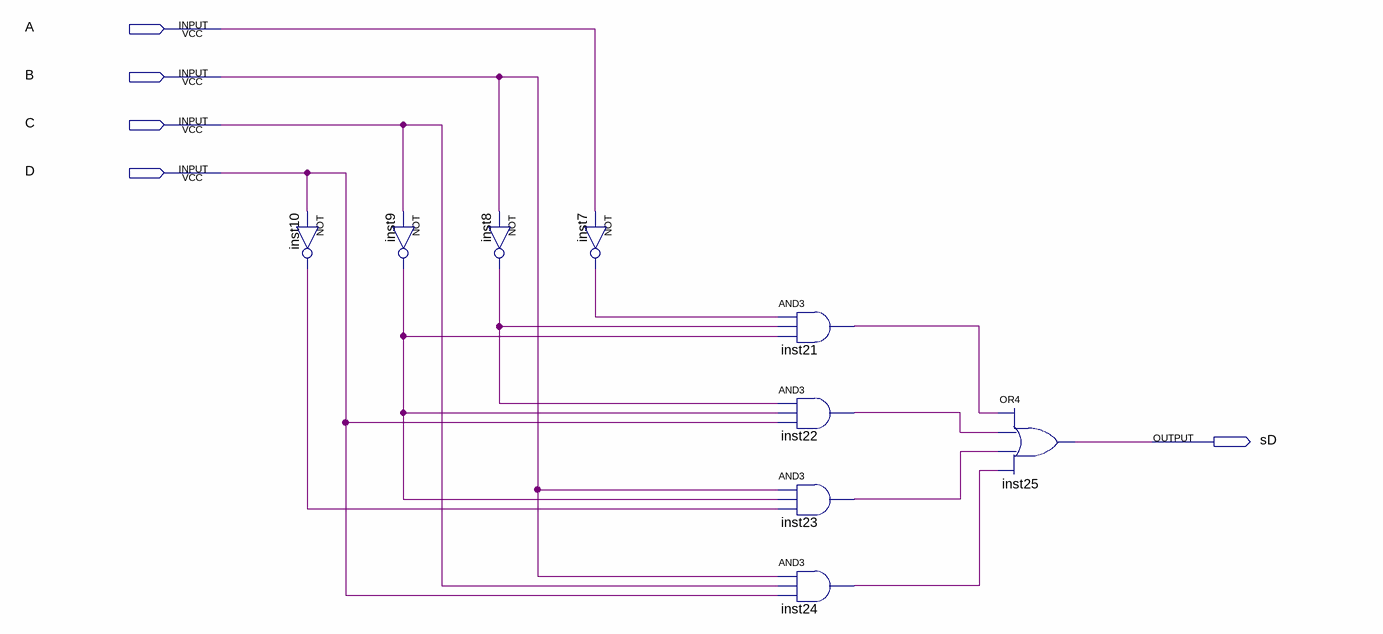
[diagram p0: schematic sheet]
// Quartus schematic decodificadorParcelaSaidaD.bdf as structural Verilog: 9 symbols, 5 pins
module decodificadorParcelaSaidaD (
  input  A,
  input  B,
  input  C,
  input  D,
  output sD
);

  wire inst7_out, inst8_out, inst9_out, inst10_out, inst21_out, inst22_out, inst23_out, inst24_out;

  not inst10 (inst10_out, D);
  not inst9 (inst9_out, C);
  not inst8 (inst8_out, B);
  not inst7 (inst7_out, A);
  and inst21 (inst21_out, inst7_out, inst8_out, inst9_out);
  and inst22 (inst22_out, inst8_out, inst9_out, D);
  and inst23 (inst23_out, B, inst9_out, inst10_out);
  and inst24 (inst24_out, B, C, D);
  or inst25 (sD, inst21_out, inst22_out, inst23_out, inst24_out);
endmodule
